# Altium schematic sheet zas_symetryczny.SchDoc
size A4; SheetNumber: 1; SheetTotal: 1
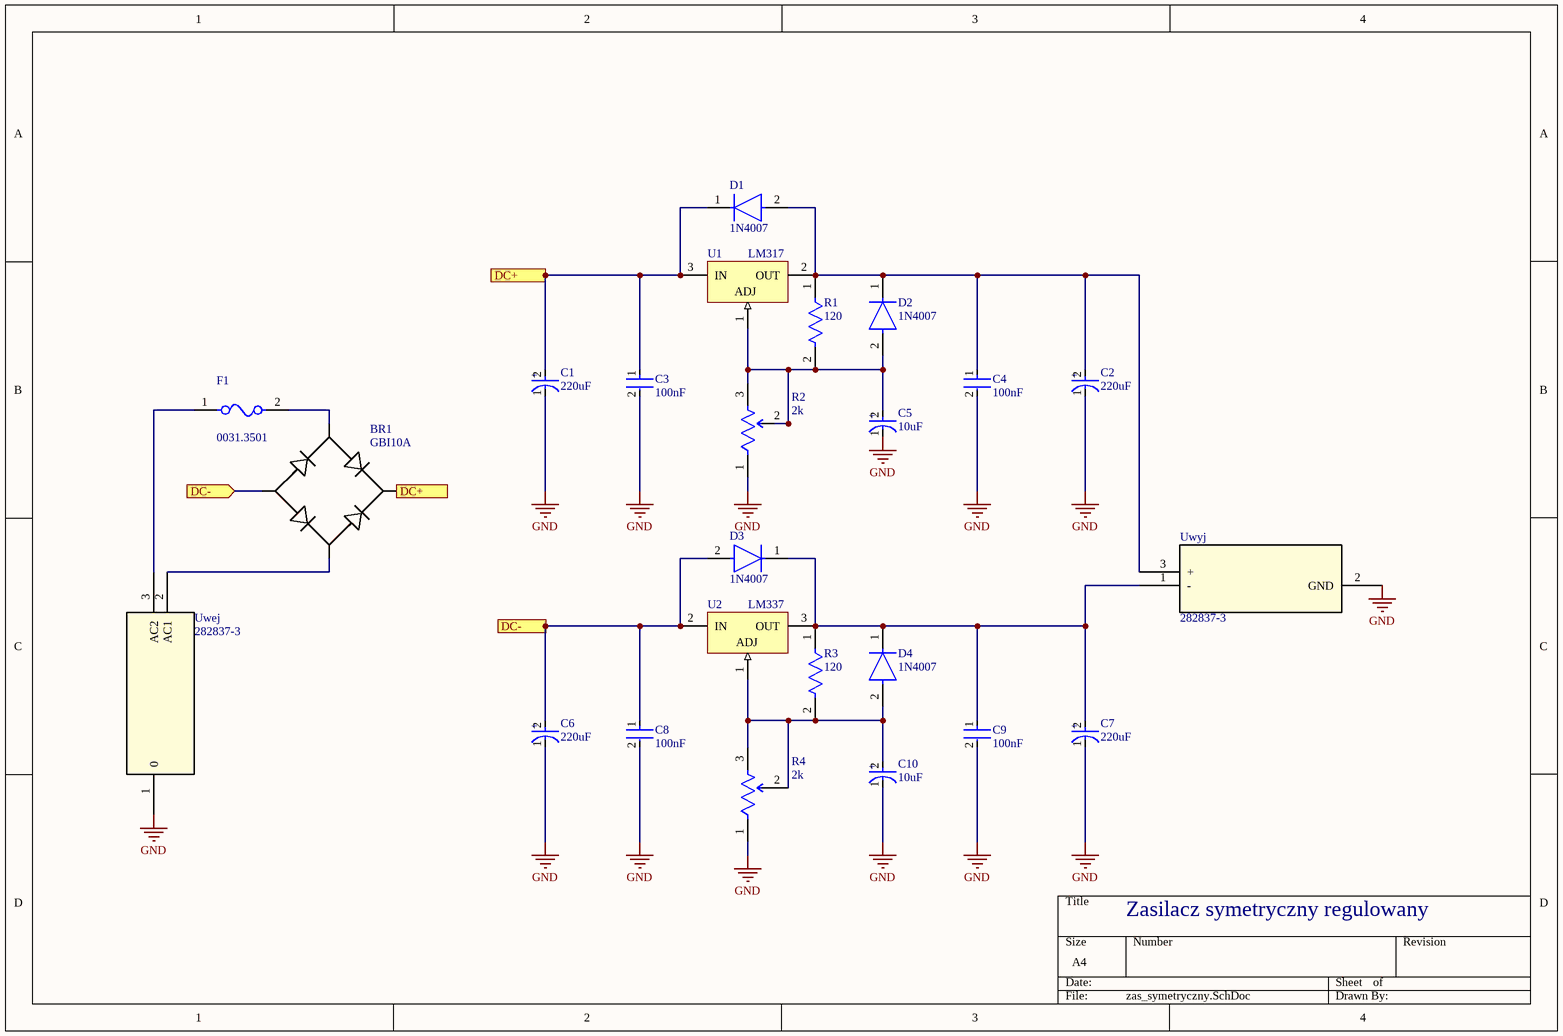
[diagram p0: zas_symetryczny.SchDoc]

## Parts
BR1  GBI10A  [BxxC5000-3000ABxxC5000-3300A_DTC]
C1  220uF  [FP-KZN-H15-MFG]
C2  220uF  [FP-KZN-H15-MFG]
C3  100nF  [FP-RDE0M1-MFG]
C4  100nF  [FP-RDE0M1-MFG]
C5  10uF  [FP-RAD-TH-D_5_0_5-L_11_1-MFG]
C6  220uF  [FP-KZN-H15-MFG]
C7  220uF  [FP-KZN-H15-MFG]
C8  100nF  [FP-RDE0M1-MFG]
C9  100nF  [FP-RDE0M1-MFG]
C10  10uF  [FP-RAD-TH-D_5_0_5-L_11_1-MFG]
D1  1N4007  [FP-1N4007-MFG]
D2  1N4007  [FP-1N4007-MFG]
D3  1N4007  [FP-1N4007-MFG]
D4  1N4007  [FP-1N4007-MFG]
F1  0031.3501  [FP-0031_3501-MFG]
R1  120  [FP-MBB0207-MFG]
R2  2k  [FP-3296Y-MFG]
R3  120  [FP-MBB0207-MFG]
R4  2k  [FP-3296Y-MFG]
U1  LM317  [NDE0003A]
U2  LM337  [TO220]
Uwej  282837-3  [282837-3_TYC]
Uwyj  282837-3  [282837-3_TYC]

## Ports
DC+ (in, see zas_symetryczny[2B]), DC- (in, see zas_symetryczny[1B]), DC- (in, see zas_symetryczny[2C])

## Nets
GND: C1.1(C) C2.1(C) C3.2 C4.2 C5.1(C) C6.1(C) C7.1(C) C8.2 C9.2 C10.1(C) R2.1(CCW) R4.1(CCW) Uwej.1(0) Uwyj.2(GND)
DC+: BR1.1 C1.2(A) C3.1 D1.1(C) U1.3(IN) ; port DC+
DC-: BR1.4 C6.2(A) C8.1 D3.2(A) U2.2(IN) ; port DC-
NetBR1_2: BR1.2 F1.2
NetBR1_3: BR1.3 Uwej.2(AC1)
NetC2_2: C2.2(A) C4.1 D1.2(A) D2.1(C) R1.1 U1.2(OUT) Uwyj.3(+)
NetC5_2: C5.2(A) D2.2(A) R1.2 R2.2(WIPER) R2.3(CW) U1.1(ADJ)
NetC7_2: C7.2(A) C9.1 D3.1(C) D4.1(C) R3.1 U2.3(OUT) Uwyj.1(-)
NetC10_2: C10.2(A) D4.2(A) R3.2 R4.2(WIPER) R4.3(CW) U2.1(ADJ)
NetF1_1: F1.1 Uwej.3(AC2)

## Notes on the sheet
- Zasilacz symetryczny regulowany
- (in symbol CMP-05427-001989-1) +
- (in symbol CMP-33768-000022-1) +

## Library data of the parts
BR1 = B80C5000-3300A: No Description Available; Mfr_Name: Diotec
C1 C2 C6 C7 = CMP-33768-000022-1: CAP ALUM 220UF 20% 50V RADIAL; Lead/Base Style: Straight; Life (Hours): 10000Hour; Capacitance: 470uF; Impedance: 59mR; Voltage Rating (DC): 25V; Ripple Current: 1.6A; Case/Package: Radial; Lead Pitch: 0.138inch; Height: 8mm; Mount: Through Hole; Length: 15mm; Packaging: Bulk; Tolerance: 20%; Termination: Radial; Max Operating Temperature: 105°C; Height - Seated (Max): 0.65inch; Package Quantity: 1000; Series: KZN; RoHS Compliant: Yes; Diameter: 8mm; Voltage Rating: 25V; Width: 8mm
C3 C4 C8 C9 = CMP-06035-051680-1: Ceramic Capacitor 100nF ±10% 50V X7R Radial; Lead/Base Style: Kinked; Lead Diameter: 0.5mm; Lead Free: Lead Free; Mount: Through Hole; Package Quantity: 2000; Lead Pitch: 0.197inch; Capacitance: 100nF; Case/Package: Radial; Tolerance: 10%; Height - Seated (Max): 0.236inch; Max Operating Temperature: 125°C; Dielectric: X7R; Min Operating Temperature: -55°C; Voltage Rating (DC): 50V; Voltage Rating: 50V; Termination: Radial; Height: 3.5mm; Resistor Type: Ceramic; Width: 3.5mm; Packaging: Tape and Reel; Length: 0.157inch
C5 C10 = CMP-05427-001989-1: CAP ALUM 10UF 20% 5V RADIAL; Ripple Current: 155mA; Polarity: Polar; ESR (Equivalent Series Resistance): 1.3R; Voltage Rating: 50V; Life (Hours): 1000Hour; Capacitance: 22uF; Leakage Current: 3uA; Lead Diameter: 0.5mm; Termination: Radial; Radiation Hardening: No; RoHS Compliant: Yes; Case/Package: Radial; Height: 11mm; Package Quantity: 2000; Min Operating Temperature: -55°C; Length: 11mm; Contact Plating: Tin; Series: FC; Diameter: 5mm; Features: General Purpose; Max Operating Temperature: 105°C; Tolerance: 20%; Voltage Rating (DC): 50V; Mount: Through Hole; Impedance: 1.3R; Lead Pitch: 0.197inch; Packaging: Tape and Reel; Height - Seated (Max): 0.472inch
D1-D4 = CMP-123542-000001-1: Rectifier diode 1000 V 1 A DO-41, ,; Manufacturer: Diotec; Max Surge Forward Current: 27A; Forward Current: 1A; Max Junction Temp: +175°C; Reverse Voltage: 1000V; Value: 15pF; Peak Reverse Current: 5uA; Category: Diode; Temperature Range Low: -50°C; Automotive: No; Temperature: -50°C to +175°C; Lead Free: Yes; ComponentLink2Description: Datasheet; Max Repetitive Reverse Voltage: 1000V; ComponentLink2URL: https://datasheet.octopart.com/1N4007-Diotec-datasheet-62346875.pdf; Manufacturer Part Number: 1N4007; Device Class L3: Rectifier Diodes; Height: 2.8mm; Octopart: https://octopart.com/1n4007-diotec-4040411; Package: 1N4007; Temperature Range High: +175°C; Device Class L1: Discrete Semiconductors; Device Class L2: Diodes; RoHS: TRUE; Capacitance: 15pF; Ipc Land Pattern Name: DIOAD888W100L520D280
F1 = CMP-26292-000003-1: FUSE HOLDER CART 250V 6.3A PCB; Manufacturer: Schurter; Number Of Fuses: 1; Conn Orientation: Right Angle; Automotive: No; Ambient Temperature Range Low: -40°C; Device Class L1: Circuit Protection; Lead Free: Yes; ComponentLink2URL: https://us.schurter.com/bundles/snceschurter/epim/_ProdPool_/newDS/en/typ_FAS.pdf; Octopart: https://octopart.com/0031.3501-schurter-742824; Device Class L3: unset; ComponentLink2Description: Datasheet; Manufacturer Part Number: 0031.3501; Voltage Rating Ac: 250V; Digikey Description: FUSE HOLDER CART 250V 6.3A PCB; RoHS: TRUE; Mouser Description: Fuse Holder FAS F'GRIP/SLOT; Height: 10mm; Category: Fuse; Voltage Rating Dc: 250V; Device Class L2: Fuse Holders; Package: 0; Ambient Temperature Range High: +85°C; Fuse Current: 6.3A
R1 R3 = CMP-02408-000026-1: RES120 ohm; Max Power Dissipation: 600mW; Resistance: 620R; Temperature Coefficient: 50ppm/°C; Tolerance: 1%; Construction: Cylindrical; RoHS Compliant: Yes; Radiation Hardening: No; Min Operating Temperature: -55°C; Resistor Type: Metal Film; Diameter: 2.5mm; Lead Free: Lead Free; Technology: THIN FILM; Packaging: Tape and Reel; Series: MBB 0207 - Professional; Military Standard: Not; Mount: Through Hole; Case/Package: Axial; Termination: Axial; Max Operating Temperature: 155°C; Contact Plating: Tin; Features: Automotive AEC-Q200; Power Rating: 600mW; Number of Terminations: 2; Length: 6.5mm
R2 R4 = CMP-07234-000015-2: TRIMMER 10K OHM 0.5W PC PIN TOP; Manufacturer Series: 3296; Resistance: 10kR; Actuator Orientation: Vertical; Power Rating: 500mW; Temperature Coefficient: 100ppm/°C; Resistance Tolerance: 10%; Resistance Law: Linear; Number of Turns: 25; Actuator Type: SCREW; Number of Terminals/Pins: 3; Insulation Resistance: 1GR; Military Standard: Not; REACH SVHC: No SVHC; Lead Free: Lead Free; Resistor Type: Cermet; Max Operating Temperature: 125°C; Radiation Hardening: No; Package Quantity: 50; Mount: Panel; Max Power Dissipation: 500mW; Min Operating Temperature: -55°C; Type: Potentiometer; Terminal Finish: Tin; Termination: Pin; Taper: Linear; Color: Blue; Technology: CERMET; Packaging: Rail/Tube; Weight: 0.03oz; Height: 0.395inch; Number of Pins: 3; RoHS Compliant: Yes; Width: 9.53mm; Tolerance: 10%; Depth: 4.83mm; Series: 3296; Length: 9.53mm
U1 = CMP-0062-02456-3: 3-Terminal Adjustable Regulator, 3-pin TO-220; Manufacturer: Texas Instruments; CompType: LDO IC; PowerWise: N; PackageTopMarking: NSUZXYTTE#*LM317T P+; ComponentLink1Description: Datasheet URL; PackageReference: NDE0003A; PinCount: 3; ComponentLink1URL: http://www.ti.com/general/docs/lit/getliterature.tsp?genericPartNumber=LM317-N&fileType=pdf; RoHS: N; PackageDescription: TO-220, Molded, 3 Lead, Straight
U2 = CMP-0244-00420-1: Three-Terminal Negative Voltage Regulator, 3-Pin TO-220; PackageReference: TO220; DatasheetVersion: 1/10/2011; ComponentLink3Description: Package Specification; ComponentLink3URL: http://www.st.com/internet/com/TECHNICAL_RESOURCES/TECHNICAL_LITERATURE/PACKAGE_INFORMATION/CD00004649.pdf; PackageDescription: TO, Thru-Hole, Vertical, Heatsink Mounted; 3 In-Line Leads; Pitch 2.54 mm; PackageVersion: ver3.0; ComponentLink1Description: Manufacturer URL; ComponentLink1URL: http://www.st.com; ComponentLink2Description: Datasheet; ComponentLink2URL: http://www.st.com/internet/com/TECHNICAL_RESOURCES/TECHNICAL_LITERATURE/DATASHEET/CD00000468.pdf
Uwej = 282837-3: Mfr_Name: TE Connectivity; RefDes: RefDes; Type: Type
Uwyj = 282837-3: No Description Available; Mfr_Name: TE Connectivity; RefDes: RefDes; Type: Type